# EAGLE design hermesONE Mini v1.0 (EAGLE 5.10)
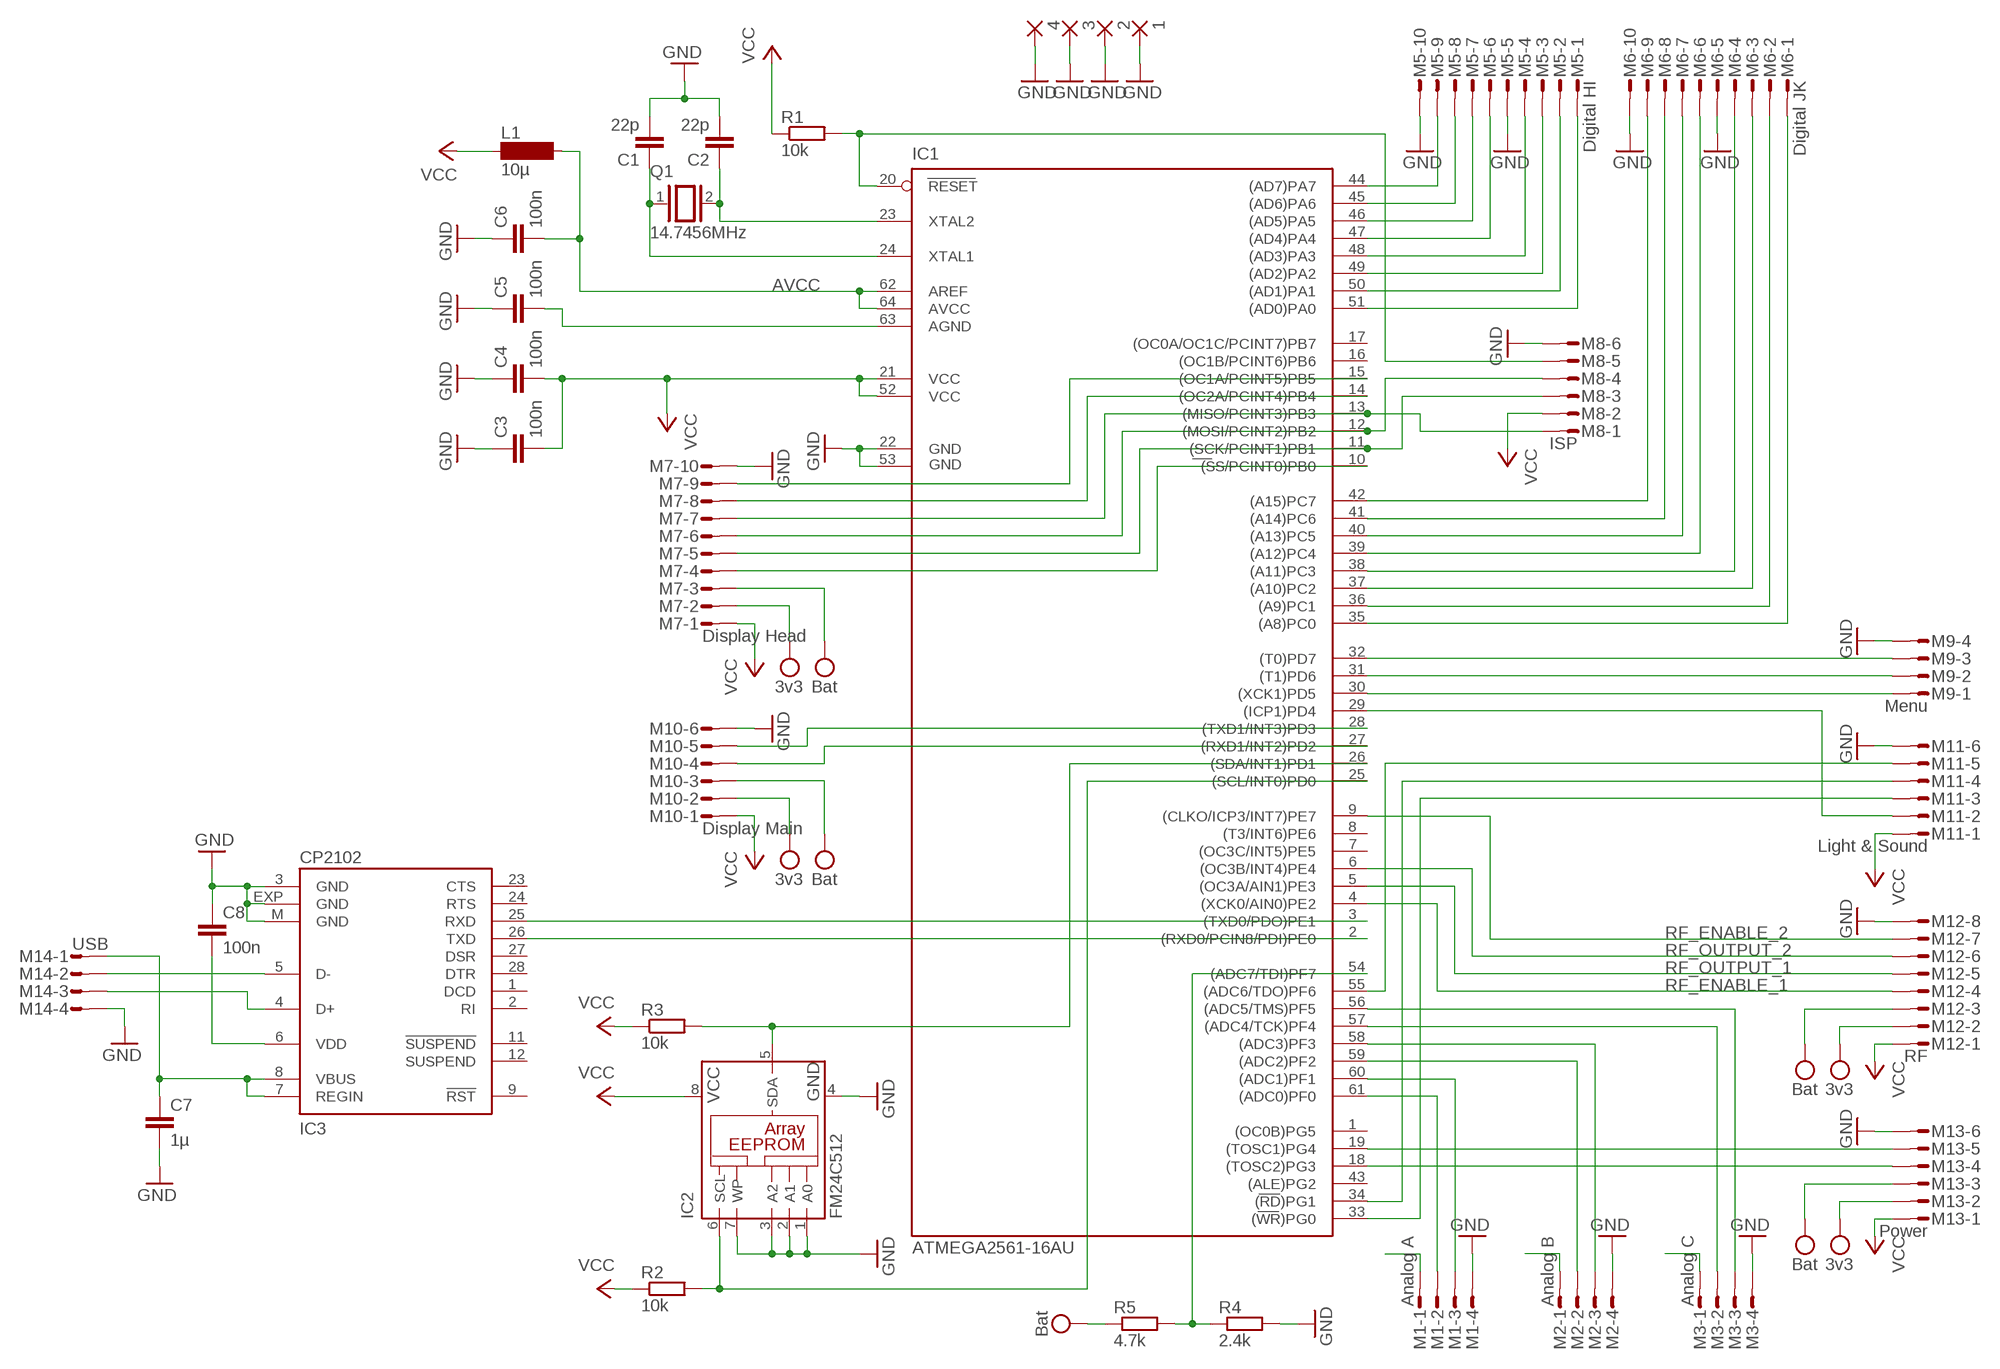
[diagram p0: schematic, sheet 1]

## Parts
1  2,54/1,1  [2,54/1,1]
2  2,54/1,1  [2,54/1,1]
3  2,54/1,1  [2,54/1,1]
4  2,54/1,1  [2,54/1,1]
C1  22p  C-EUC0805  [C0805]
C2  22p  C-EUC0805  [C0805]
C3  100n  C-EUC0805  [C0805]
C4  100n  C-EUC0805  [C0805]
C5  100n  C-EUC0805  [C0805]
C6  100n  C-EUC0805  [C0805]
C7  1µ  C-EUC0805  [C0805]
C8  100n  C-EUC0805  [C0805]
IC1  ATMEGA2561-16AU  [TQFP64]
IC2  FM24C512  24C64SM  [SO-08M]
IC3  CP2102  [MLP28]
L1  10µ  SM-1206  [SM-1206]
M1  Analog A  MICROMATCH-4  [MICROMATCH-4]
M2  Analog B  MICROMATCH-4  [MICROMATCH-4]
M3  Analog C  MICROMATCH-4  [MICROMATCH-4]
M5  Digital HI  MICROMATCH-10  [MICROMATCH-10]
M6  Digital JK  MICROMATCH-10  [MICROMATCH-10]
M7  Display Head  MICROMATCH-10  [MICROMATCH-10]
M8  ISP  MICROMATCH-6  [MICROMATCH-6]
M9  Menu  MICROMATCH-4  [MICROMATCH-4]
M10  Display Main  MICROMATCH-6  [MICROMATCH-6]
M11  Light & Sound  MICROMATCH-6  [MICROMATCH-6]
M12  RF  MICROMATCH-8  [MICROMATCH-8]
M13  Power  MICROMATCH-6  [MICROMATCH-6]
M14  USB  MICROMATCH-4  [MICROMATCH-4]
Q1  14.7456MHz  XTAL/S  [QS]
R1  10k  R-EU_R0805  [R0805]
R2  10k  R-EU_R0805  [R0805]
R3  10k  R-EU_R0805  [R0805]
R4  2.4k  R-EU_R0805  [R0805]
R5  4.7k  R-EU_R0805  [R0805]

## Nets
3V3: M7.2 M10.2 M12.2 M13.2 ; supply symbol labelled 3v3
ADC7: IC1.54((ADC7/TDI)PF7) R4.1 R5.2
AVCC: C6.2 IC1.62(AREF) IC1.64(AVCC) L1.2 M1.1 M2.1 M3.1
BAT: M7.3 M10.3 M12.3 M13.3 R5.1 ; supply symbol labelled Bat
GND: 1.1(P) 2.1(P) 3.1(P) 4.1(P) C1.2 C2.2 C3.1 C4.1 C5.1 C6.1 C7.2 C8.1 IC1.22(GND) IC1.53(GND1) IC2.1(A0) IC2.2(A1) IC2.3(A2) IC2.4(GND) IC2.7(WP) IC3.3(GND) IC3.EXP(GND) IC3.M(GND) M1.4 M2.4 M3.4 M5.5 M5.10 M6.5 M6.10 M7.10 M8.6 M9.4 M10.6 M11.6 M12.8 M13.6 M14.4 R4.2
N$1: C1.1 IC1.24(XTAL1) Q1.1
N$2: C2.1 IC1.23(XTAL2) Q1.2
N$4: IC3.5(D-) M14.2
N$6: IC1.51((AD0)PA0) M5.1
N$7: C5.2 IC1.63(AGND)
N$8: IC1.20(RESET) M8.5 R1.2
N$9: IC1.50((AD1)PA1) M5.2
N$10: IC1.11((SCK/PCINT1)PB1) M7.5 M8.3
N$11: IC1.12((MOSI/PCINT2)PB2) M7.6 M8.4
N$12: IC1.13((MISO/PCINT3)PB3) M7.7 M8.1
N$13: IC1.49((AD2)PA2) M5.3
N$14: IC1.48((AD3)PA3) M5.4
N$15: IC1.47((AD4)PA4) M5.6
N$16: IC1.46((AD5)PA5) M5.7
N$17: IC1.45((AD6)PA6) M5.8
N$18: IC1.44((AD7)PA7) M5.9
N$19: IC1.35((A8)PC0) M6.1
N$20: IC1.36((A9)PC1) M6.2
N$21: IC1.37((A10)PC2) M6.3
N$22: IC1.38((A11)PC3) M6.4
N$23: IC1.39((A12)PC4) M6.6
N$24: IC1.40((A13)PC5) M6.7
N$25: IC1.41((A14)PC6) M6.8
N$26: IC1.42((A15)PC7) M6.9
N$27: IC1.61((ADC0)PF0) M1.2
N$28: IC1.60((ADC1)PF1) M1.3
N$29: IC1.55((ADC6/TDO)PF6) M11.5
N$30: IC1.59((ADC2)PF2) M2.2
N$31: IC1.58((ADC3)PF3) M2.3
N$32: IC1.57((ADC4/TCK)PF4) M3.2
N$33: IC1.56((ADC5/TMS)PF5) M3.3
N$35: IC1.10((SS/PCINT0)PB0) M7.4
N$36: IC1.14((OC2A/PCINT4)PB4) M7.8
N$37: IC1.15((OC1A/PCINT5)PB5) M7.9
N$38: IC1.26((SDA/INT1)PD1) IC2.5(SDA) R3.2
N$39: IC1.2((RXD0/PCIN8/PDI)PE0) IC3.26(TXD)
N$40: IC1.30((XCK1)PD5) M9.1
N$41: IC1.31((T1)PD6) M9.2
N$42: IC1.32((T0)PD7) M9.3
N$43: IC1.27((RXD1/INT2)PD2) M10.4
N$44: IC1.28((TXD1/INT3)PD3) M10.5
N$45: IC1.29((ICP1)PD4) M11.2
N$49: IC1.33((WR)PG0) M11.3
N$50: IC1.34((RD)PG1) M11.4
N$51: IC1.18((TOSC2)PG3) M13.4
N$52: IC1.19((TOSC1)PG4) M13.5
N$54: IC3.4(D+) M14.3
N$55: C7.1 IC3.7(REGIN) IC3.8(VBUS) M14.1
N$56: C8.2 IC3.6(VDD)
N$57: IC1.3((TXD0/PDO)PE1) IC3.25(RXD)
RF_ENABLE_1: IC1.4((XCK0/AIN0)PE2) M12.4
RF_ENABLE_2: IC1.9((CLKO/ICP3/INT7)PE7) M12.7
RF_OUTPUT_1: IC1.5((OC3A/AIN1)PE3) M12.5
RF_OUTPUT_2: IC1.6((OC3B/INT4)PE4) M12.6
SCL: IC1.25((SCL/INT0)PD0) IC2.6(SCL) R2.2
VCC: C3.2 C4.2 IC1.21(VCC) IC1.52(VCC1) IC2.8(VCC) L1.1 M7.1 M8.2 M10.1 M11.1 M12.1 M13.1 R1.1 R2.1 R3.1
Unconnected: IC1.1((OC0B)PG5) IC1.7((OC3C/INT5)PE5) IC1.8((T3/INT6)PE6) IC1.16((OC1B/PCINT6)PB6) IC1.17((OC0A/OC1C/PCINT7)PB7) IC1.43((ALE)PG2) IC3.1(DCD) IC3.2(RI) IC3.9(!RST) IC3.11(!SUSPEND) IC3.12(SUSPEND) IC3.23(CTS) IC3.24(RTS) IC3.27(DSR) IC3.28(DTR)

## Library data of the parts
1-4 = wirepad:2,54/1,1: THROUGH-HOLE PAD
C1-C8 = rcl:C-EU: CAPACITOR, European symbol
IC1 = atmel-2005:ATMEGA2561*: MICROCONTROLLER 256 Kbytes FLASH 4 Kbytes EEPROM 8 Kbytes SRAM 54 General Purpose I/O pins 6-channels 16-bit PWM 2 x Serial USARTs 8-channels 10-bit A/D
IC2 = microchip:24*: Serial EEPROM I2C
IC3 = silabs:CP210*: Single-Chip USB to UART Bridge Source: www.silabs.com .. CP2101.pdf / cp2102.pdf
L1 = inductor-neosid:SM-1206: INDUCTOR SMD chip inductor
M1-M3 M9 M14 = con-amp-micromatch:MICROMATCH-4: MicroMaTch 4 7-215464-4 / 0-215464-4 Drawing Number C-215464 DDEController.pdf
M5-M7 = con-amp-micromatch:MICROMATCH-10: MicroMaTch 10 8-215464-0 / 1-215464-0 Drawing Number C-215464 DDEController.pdf
M8 M10 M11 M13 = con-amp-micromatch:MICROMATCH-6: MicroMaTch 6 7-215464-6 / 0-215464-6 Drawing Number C-215464 DDEController.pdf
M12 = con-amp-micromatch:MICROMATCH-8: MicroMaTch 8 7-215464-8 / 0-215464-8 Drawing Number C-215464 DDEController.pdf
Q1 = special:XTAL/S: CRYSTAL
R1-R5 = rcl:R-EU_: RESISTOR, European symbol

## Board
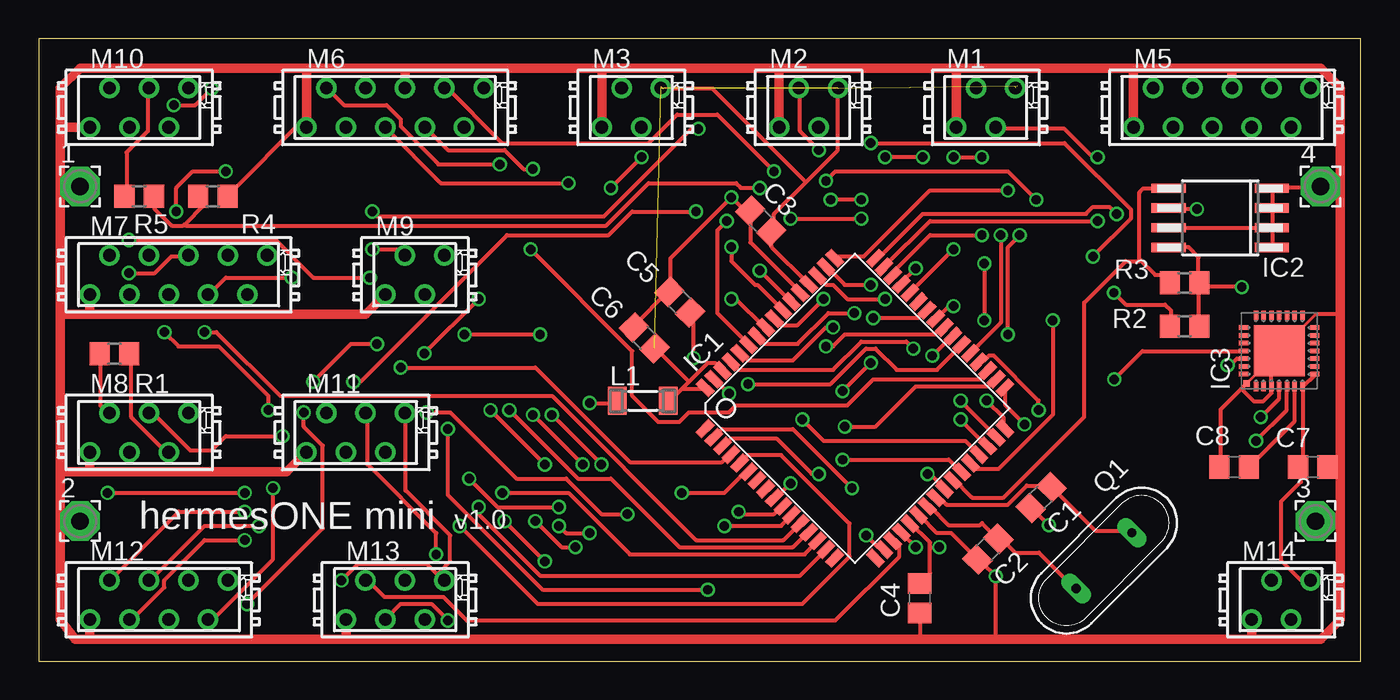
[diagram p1: board, top side]
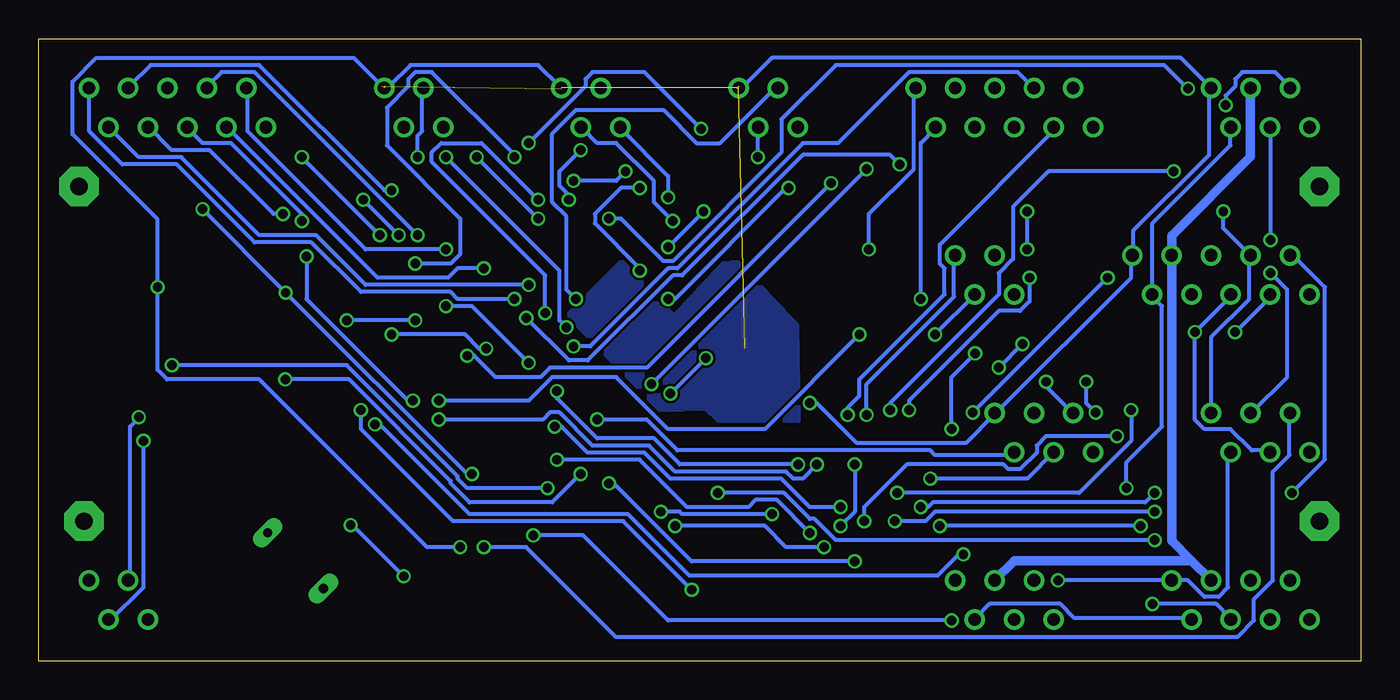
[diagram p2: board, bottom side, seen from below]

Size 85.27 x 40.12 mm. Coordinates in mm from the lower left corner, seen from the top.
Outline: 0,0 85.27,0 85.27,40.12 0,40.12 0,0
Copper layers (1*16): Top 0.035mm / dielectric 1.5mm / Bottom 0.035mm
Design rules "default *": minimum track width 8mil, minimum drill 24mil, track to track 6mil, track to pad 6mil, pad to pad 6mil, via to via 6mil, smd to smd 6mil, copper to edge 40mil, drill to drill 6mil, minimum pad ring 10mil, minimum via ring 6mil, stop-mask expansion 4mil, vias tented up to drill 0mil, thermal gap 10mil

### Footprints (pad centres in the part's own frame; a part is rotated, then mirrored left to right if it is on the bottom)
2,54/1,1 = drill 1.118 pad 2.54 octagon: 1 0,0
C0805 = smd 1.3 x 1.5: 1 -0.95,0; 2 0.95,0
TQFP64 = smd 1.194 x 0.559: 1 -7.76,5.905; 2 -7.76,5.118; 3 -7.76,4.331; 4 -7.76,3.543; 5 -7.76,2.756; 6 -7.76,1.968; 7 -7.76,1.181; 8 -7.76,0.394; 9 -7.76,-0.394; 10 -7.76,-1.181; 11 -7.76,-1.968; 12 -7.76,-2.756; 13 -7.76,-3.543; 14 -7.76,-4.331; 15 -7.76,-5.118; 16 -7.76,-5.905; 33 7.76,-5.905; 34 7.76,-5.118; 35 7.76,-4.331; 36 7.76,-3.543; 37 7.76,-2.756; 38 7.76,-1.968; 39 7.76,-1.181; 40 7.76,-0.394; 41 7.76,0.394; 42 7.76,1.181; 43 7.76,1.968; 44 7.76,2.756; 45 7.76,3.543; 46 7.76,4.331; 47 7.76,5.118; 48 7.76,5.905 | smd 0.559 x 1.194: 17 -5.905,-7.76; 18 -5.118,-7.76; 19 -4.331,-7.76; 20 -3.543,-7.76; 21 -2.756,-7.76; 22 -1.968,-7.76; 23 -1.181,-7.76; 24 -0.394,-7.76; 25 0.394,-7.76; 26 1.181,-7.76; 27 1.968,-7.76; 28 2.756,-7.76; 29 3.543,-7.76; 30 4.331,-7.76; 31 5.118,-7.76; 32 5.905,-7.76; 49 5.905,7.76; 50 5.118,7.76; 51 4.331,7.76; 52 3.543,7.76; 53 2.756,7.76; 54 1.968,7.76; 55 1.181,7.76; 56 0.394,7.76; 57 -0.394,7.76; 58 -1.181,7.76; 59 -1.968,7.76; 60 -2.756,7.76; 61 -3.543,7.76; 62 -4.331,7.76; 63 -5.118,7.76; 64 -5.905,7.76
SO-08M = smd 0.6 x 2.2: 1 -1.905,-3.33; 2 -0.635,-3.33; 3 0.635,-3.33; 4 1.905,-3.33; 5 1.905,3.33; 6 0.635,3.33; 7 -0.635,3.33; 8 -1.905,3.33
MLP28 = smd 0.6 x 0.3: 1 -2.3,1.5; 2 -2.3,1; 3 -2.3,0.5; 4 -2.3,0; 5 -2.3,-0.5; 6 -2.3,-1; 7 -2.3,-1.5; 15 2.3,-1.5; 16 2.3,-1; 17 2.3,-0.5; 18 2.3,0; 19 2.3,0.5; 20 2.3,1; 21 2.3,1.5 | smd 0.3 x 0.6: 8 -1.5,-2.3; 9 -1,-2.3; 10 -0.5,-2.3; 11 0,-2.3; 12 0.5,-2.3; 13 1,-2.3; 14 1.5,-2.3; 22 1.5,2.3; 23 1,2.3; 24 0.5,2.3; 25 0,2.3; 26 -0.5,2.3; 27 -1,2.3; 28 -1.5,2.3 | smd 3.3 x 3.3: EXP 0,0 | smd 0.435 x 0.435: M -2.103,2.103
SM-1206 = smd 1.2 x 1.8: 1 -1.65,0; 2 1.65,0
MICROMATCH-4 = drill 0.813 round: 1 1.905,1.27; 2 0.635,-1.27; 3 -0.635,1.27; 4 -1.905,-1.27
MICROMATCH-10 = drill 0.813 round: 1 5.715,1.27; 2 4.445,-1.27; 3 3.175,1.27; 4 1.905,-1.27; 5 0.635,1.27; 6 -0.635,-1.27; 7 -1.905,1.27; 8 -3.175,-1.27; 9 -4.445,1.27; 10 -5.715,-1.27
MICROMATCH-6 = drill 0.813 round: 1 3.175,1.27; 2 1.905,-1.27; 3 0.635,1.27; 4 -0.635,-1.27; 5 -1.905,1.27; 6 -3.175,-1.27
MICROMATCH-8 = drill 0.813 round: 1 4.445,1.27; 2 3.175,-1.27; 3 1.905,1.27; 4 0.635,-1.27; 5 -0.635,1.27; 6 -1.905,-1.27; 7 -3.175,1.27; 8 -4.445,-1.27
QS = drill 0.61 long: 1 -2.54,0; 2 2.54,0
R0805 = smd 1.3 x 1.5: 1 -0.95,0; 2 0.95,0

### Placement (x,y rotation side)
1  2.67,30.61 0 top
2  2.67,9.02 0 top
3  82.36,9.02 0 top
4  82.68,30.61 0 top
C1  64.64,10.54 225 top
C2  61.22,7.21 225 top
C3  46.57,28.37 315 top
C4  56.82,4.05 90 top
C5  41.33,23.14 315 top
C6  39.05,20.84 315 top
C7  82.18,12.52 0 top
C8  77.11,12.51 0 top
IC1  52.65,16.3 45 top
IC2  76.2,28.58 90 top
IC3  80.01,20 90 top
L1  38.96,16.77 0 top
M1  61.09,35.69 0 top
M2  49.66,35.69 0 top
M3  38.23,35.69 0 top
M5  76.33,35.69 0 top
M6  22.99,35.69 0 top
M7  9.02,24.89 0 top
M8  6.48,14.73 0 top
M9  24.26,24.89 0 top
M10  6.48,35.69 0 top
M11  20.45,14.73 0 top
M12  7.75,3.94 0 top
M13  22.99,3.94 0 top
M14  80.14,3.94 0 top
Q1  68.71,6.48 225 top
R1  4.89,19.81 180 top
R2  73.91,21.59 180 top
R3  73.91,24.38 180 top
R4  11.24,29.97 0 top
R5  6.48,29.97 0 top

### Tracks (layer width: path | path; a pad name or v marks a point on that pad's centre or on a via)
3V3  (via drill 0.61)
  Top 0.254: v15.11,11.15 15.11,6.58 11.3,2.77 11,2.77 M12.2
  Bottom 0.254: M12.2 11,2.77 18.47,2.77 19.38,3.68 23.95,3.68 24.87,2.77 M13.2 | M10.2 8.41,34.31 8.41,33.25 13.44,28.22 13.44,23.65 M7.2 13.44,23.5 12.83,22.89 12.83,15.11 15.11,12.83 v15.11,11.15
ADC7  (via drill 0.61)
  Top 0.254: 7.49,30.05 R5.2 7.49,29.9 7.49,29.13 8.56,28.07 9.32,28.07 9.4,28.14 | 10.24,30.05 R4.1 10.69,29.44 9.4,28.14 | v46.51,25.17 48.49,23.19 IC1.54 | v46.51,30.51 45.29,30.51 44.98,30.81 39.35,30.81 36.6,28.07 9.47,28.07 9.4,28.14
  Bottom 0.254: v46.51,25.17 46.51,25.32 49.4,28.22 49.4,28.83 47.73,30.51 v46.51,30.51
AVCC  (3 unrouted)
  Top 0.254: 41.48,17.55 42.85,17.55 IC1.64 | 41.48,17.55 40.72,16.79 L1.2 | 41.48,17.55 41.94,18.01 | 41.94,18.01 43.16,19.23 43.61,19.23 44.07,18.77 IC1.62 | 41.94,18.01 39.8,20.14 C6.2
  Bottom 0.254: 62.97,37.06 62.66,37.06 61.29,38.43 53.06,38.43 51.69,37.06 M2.1
BAT
  Top 0.254: R5.1 5.66,30.05 5.66,32.79 7.04,34.16 7.04,36.91 M10.3
  Bottom 0.61: M10.3 7.11,32.51 12.19,27.43 M7.3 12.19,7.75 10.92,6.48 | 10.92,6.48 22.35,6.48 M13.3 | M12.3 10.92,6.48
GND  (via drill 0.6, 0.61)
  Top 0.203: 82.36,22.35 | 82.36,22.35 IC3.M
  Top 0.254: 12.06,29.9 R4.2 12.22,30.05 17.09,34.93 M6.10 | 1.72,22.35 1.55,22.43 1.4,22.43 | C7.2 83.24,12.52 83.95,12.52 | IC3.M 77.9,17.86 | IC3.EXP 79.5,19.5 IC3.3 79.5,17.65 79.5,17.27 78.99,16.76 78.36,16.76 77.6,17.53 77.56,17.56 | 77.9,17.86 IC3.M | 83.95,22.35 82.36,22.35 | IC3.EXP | 77.9,17.86 77.86,17.86 77.56,17.56 | C8.1 76.23,12.52 76.23,16.22 77.56,17.56 | IC2.1 79.58,26.7 79.58,27.91 IC2.2 | IC2.7 72.87,27.91 79.43,27.91 IC2.2 | IC2.2 79.58,28.07 79.58,29.13 IC2.3 79.58,29.29 79.58,30.35 IC2.4 79.58,30.51 82.47,30.51 4.1 | IC1.22 56.87,9.32 57.94,8.25 58.85,8.25 60.53,6.58 C2.2 | C4.1 56.87,3.07 56.87,1.4 | 64.03,9.78 C1.2 64.14,9.78 v65.15,8.76 | C2.2 60.68,6.43 | C2.2 60.71,6.35 60.83,6.35 v61.72,5.46 61.72,1.4 | C6.1 38.43,21.67 40.56,23.8 C5.1 40.72,23.95 40.72,25.93 v44.68,29.9 45.44,29.13 45.75,29.13 C3.1 45.9,28.98 45.9,27 49.1,23.8 IC1.53
  Top 0.61: 1.4,9.02 1.4,12.19 | 17.27,38.23 2.67,38.23 1.4,36.96 1.4,34.42 | 17.27,38.23 23.62,38.23 | 23.62,38.23 36.32,38.23 | 36.32,38.23 47.75,38.23 | 47.75,38.23 59.18,38.23 | 59.18,38.23 70.61,38.23 | 76.96,38.23 70.61,38.23 | 76.96,38.23 82.68,38.23 83.95,36.96 83.95,30.61 | 36.32,38.23 M3.4 | 47.75,38.23 M2.4 | 59.18,38.23 M1.4 | 70.61,38.23 M5.10 | 1.4,9.02 1.4,2.67 2.35,1.4 3.3,1.4 | 1.4,9.02 2.1 | 1.4,30.61 1.4,34.42 | 1.4,30.61 1.1 | 3.3,1.4 19.81,1.4 | 76.96,38.23 M5.5 | 19.81,1.4 56.87,1.4 61.72,1.4 78.23,1.4 | 78.23,1.4 82.68,1.4 83.95,2.67 83.95,9.02 | 83.95,30.61 4.1 | 83.95,9.02 83.95,12.52 83.95,22.35 83.95,30.61 | 17.27,38.23 M6.10 | 1.4,34.42 M10.6 | 23.62,38.23 M6.5 | 83.95,9.02 3.1 | 3.3,1.4 M12.8 | 19.81,1.4 M13.6 | 78.23,1.4 M14.4 | M11.6 16,12.19 3.3,12.19 | 1.4,12.19 3.3,12.19 | 3.3,12.19 M8.6 | 1.4,12.19 1.4,22.43 1.4,30.61 | M9.4 21.08,22.35 3.3,22.35 | 1.72,22.35 3.3,22.35 | 3.3,22.35 M7.10
  Bottom 0.254: v44.68,29.9 44.68,31.27 47.73,34.31 M2.4 | v61.72,5.46 65.02,8.76 v65.15,8.76
N$1
  Top 0.254: IC1.24 57.94,10.39 58.24,10.39 58.55,10.08 62.51,10.08 63.73,11.3 65.25,11.3 C1.1 65.41,11.15 68.15,8.41 70.43,8.41 Q1.1
N$2
  Top 0.254: IC1.23 57.4,9.91 57.53,9.91 58.67,8.76 60.71,8.76 60.83,8.89 61.85,7.87 C2.1 61.98,8 62.99,6.99 64.52,6.99 66.8,4.7 Q1.2
N$3
  pour Bottom: 36.34,15.51 36.44,21.66 40.2,25.66 41.09,25.6 44.31,22.16 47.67,25.71 51.1,22.29 45.16,16.24 42.27,16.35 41.43,15.56
N$4  (via drill 0.61)
  Top 0.254: v78.51,14.2 80.49,16.18 80.49,17.55 IC3.5
  Bottom 0.254: v78.51,14.2 78.51,4.75 80.65,2.62 M14.2
N$6  (via drill 0.61)
  Top 0.254: v54.59,23.34 52.15,23.34 51.23,24.26 50.78,24.26 50.32,24.71 IC1.51
  Bottom 0.254: v54.59,23.34 58.24,23.34 58.7,23.8 64.49,23.8 67.69,27 71.35,27 76.38,32.03 79.88,32.03 82.02,34.16 82.02,36.91 M5.1
N$7  (via drill 0.61)
  Top 0.254: v44.53,17.25 43.61,18.16 IC1.63 | v42.24,19.53 42.24,22.28 42.09,22.43 C5.2
  Bottom 0.254: v44.53,17.25 v42.24,19.53
N$8  (via drill 0.61)
  Top 0.254: v56.57,7.34 55.65,8.25 IC1.20 | R1.2 3.99,19.69 3.99,16.48 4.45,16.03 M8.5
  Bottom 0.254: v56.57,7.34 53.82,7.34 48.03,1.55 7.95,1.55 6.88,2.62 6.88,3.99 5.66,5.21 5.66,12.22 4.6,13.28 4.6,15.88 M8.5
N$9  (via drill 0.61)
  Top 0.254: v53.67,24.26 51.99,24.26 50.93,25.32 IC1.50
  Bottom 0.254: v53.67,24.26 64.19,24.26 67.39,27.46 71.04,27.46 76.07,32.49 78.82,32.49 80.65,34.31 M5.2
N$10  (via drill 0.61)
  Top 0.254: v44.22,8.71 47.88,8.71 48.49,9.32 IC1.11 | v34.62,7.34 33.71,7.34 v32.03,9.02 | v15.72,14.5 12.06,14.5 11.15,13.59 9.78,13.59 7.49,15.88 7.19,15.88 M8.3 | v5.82,25.02 7.49,25.02 8.56,26.09 9.63,26.09 M7.5
  Bottom 0.254: v44.22,8.71 38.43,8.71 37.06,7.34 v34.62,7.34 | v32.03,9.02 32.03,9.93 29.29,12.68 23.04,12.68 22.73,12.37 21.97,12.37 20.9,13.44 20.9,13.89 20.29,14.5 v15.72,14.5 | v5.82,25.02 4.75,23.95 4.75,18.31 7.04,16.03 M8.3
N$11  (via drill 0.61)
  Top 0.254: v10.69,21.21 11.46,21.21 15.57,17.09 33.1,17.09 42.39,7.8 48.03,7.8 IC1.12
  Bottom 0.254: M7.6 8.41,23.5 v10.69,21.21 10.69,15.57 10.08,14.96 8.41,14.96 7.04,13.59 5.97,13.59 M8.4
N$12  (via drill 0.61)
  Top 0.254: v30.35,16.18 34.77,11.76 36.91,11.76 41.33,7.34 48.64,7.34 49.56,8.25 IC1.13 | v12.06,31.57 9.93,31.57 8.87,30.51 v8.87,28.98
  Bottom 0.254: v30.35,16.18 30.35,16.64 23.34,23.65 23.34,25.02 22.43,25.93 22.43,29.29 20.14,31.57 v12.06,31.57 | v8.87,28.98 8.87,27.91 M7.7 7.19,26.09 7.19,23.34 9.63,20.9 9.63,16.03 M8.1
N$13  (via drill 0.61)
  Top 0.254: v62.51,30.35 57.48,30.35 53.21,26.09 51.38,26.09 IC1.49
  Bottom 0.254: v62.51,30.35 62.97,30.35 71.04,38.43 78.05,38.43 79.43,37.06 M5.3
N$14  (via drill 0.61)
  Top 0.254: v69.52,28.83 69.06,29.29 68,29.29 67.54,28.83 57.02,28.83 54.28,26.09 53.98,26.09 IC1.48
  Bottom 0.254: v69.52,28.83 70.13,28.83 74.24,32.94 76.68,32.94 78.21,34.47 M5.4
N$15  (via drill 0.61)
  Top 0.254: v68.3,28.37 57.48,28.37 54.59,25.48 IC1.47
  Bottom 0.254: v68.3,28.37 68.3,28.83 72.87,33.4 74.7,33.4 75.62,34.31 M5.6
N$16  (via drill 0.61)
  Top 0.254: v60.83,27.46 57.48,27.46 55.19,25.17 55.19,24.87 IC1.46
  Bottom 0.254: v60.83,27.46 71.35,37.97 73.48,37.97 74.4,37.06 M5.7
N$17  (via drill 0.61)
  Top 0.254: v56.57,25.32 55.65,24.41 IC1.45
  Bottom 0.254: v56.57,25.32 58.24,25.32 58.85,24.71 63.42,24.71 73.03,34.31 M5.8
N$18  (via drill 0.61)
  Top 0.254: v59,26.54 56.26,23.8 IC1.44
  Bottom 0.254: v59,26.54 64.19,26.54 71.81,34.16 71.81,36.91 M5.9
N$19  (via drill 0.61)
  Top 0.254: v31.72,26.54 38.28,19.99 38.28,17.09 39.95,15.42 41.33,15.42 41.94,16.03 44.53,16.03 44.98,16.48 52.15,16.48 53.82,18.16 60.68,18.16 61.14,18.62 IC1.35
  Bottom 0.254: v31.72,26.54 31.72,28.83 28.83,31.73 28.83,36.91 M6.1
N$20  (via drill 0.61)
  Top 0.254: v64.49,16.18 64.49,16.79 61.59,19.69 61.29,19.69 60.99,19.38 60.68,19.38 IC1.36 | v43.16,4.6 32.49,4.6 26.39,10.69 v26.39,14.96 | v24.87,19.84 v28.37,23.34
  Bottom 0.254: v64.49,16.18 64.49,14.96 58.55,9.02 47.57,9.02 v43.16,4.6 | v26.39,14.96 26.39,18.31 v24.87,19.84 | v28.37,23.34 28.37,33.4 27.46,34.31 M6.2
N$21  (via drill 0.61)
  Top 0.254: v62.05,27.46 62.05,21.82 60.22,19.99 IC1.37 | v64.34,29.74 62.51,31.57 51.38,31.57 v50.78,30.96 | v47.42,31.57 43.76,35.23 41.17,35.23 39.35,33.4 29.9,33.4 26.24,37.06 M6.3
  Bottom 0.254: v64.34,29.74 v62.05,27.46 | v50.78,30.96 48.03,30.96 v47.42,31.57
N$22  (via drill 0.61)
  Top 0.254: v45.75,17.86 51.08,17.86 53.37,20.14 53.98,20.14 55.35,18.77 57.94,18.77 59.46,20.3 IC1.38 | v31.88,31.73 31.27,31.73 30.05,32.94 26.39,32.94 25.02,34.31 M6.4
  Bottom 0.254: v31.88,31.73 v45.75,17.86
N$23  (via drill 0.61)
  Top 0.254: v57.63,19.69 58.85,20.9 IC1.39 | v34.16,30.81 25.93,30.81 22.43,34.31 M6.6
  Bottom 0.254: v57.63,19.69 57.18,19.69 55.8,18.31 52.91,18.31 52.3,18.92 46.05,18.92 v34.16,30.81
N$24  (via drill 0.61)
  Top 0.254: v50.78,20.3 51.23,20.3 51.99,21.06 57.79,21.06 58.09,21.36 58.4,21.36 IC1.40
  Bottom 0.254: v50.78,20.3 49.71,20.3 44.68,25.32 44.07,25.32 35.99,33.4 33.71,33.4 29.13,37.97 22.12,37.97 21.21,37.06 M6.7
N$25  (via drill 0.61)
  Top 0.254: v59,22.89 58.7,22.89 57.94,22.12 IC1.41 | v51.84,17.4 v53.67,19.23 | v33.1,15.88 v36.3,12.68
  Bottom 0.254: v59,22.89 57.33,22.89 v53.67,19.23 | v51.84,17.4 51.84,16.94 49.25,14.35 45.59,14.35 43.92,12.68 v36.3,12.68 | v33.1,15.88 33.1,16.33 32.33,17.09 32.33,18.16 26.85,23.65 26.85,25.32 27.15,25.63 27.15,26.85 19.68,34.31 M6.8
N$26  (via drill 0.61)
  Top 0.254: v53.82,22.12 56.72,22.12 57.18,22.58 IC1.42 | v29.74,32.03 25.78,32.03 23.34,34.47 23.34,34.93 22.43,35.84 19.68,35.84 18.62,36.91 M6.9
  Bottom 0.254: v53.82,22.12 51.08,19.38 49.86,19.38 44.37,24.87 43.76,24.87 35.99,32.64 30.35,32.64 v29.74,32.03
N$27  (via drill 0.61)
  Top 0.254: v56.41,20.14 55.96,20.6 53.06,20.6 51.23,18.77 45.14,18.77 44.68,19.23 IC1.61 | v62.51,21.06 62.51,26.7 v63.27,27.46 | v68.3,32.49 68,32.49 66.17,34.31 61.75,34.31 M1.2
  Bottom 0.254: v56.41,20.14 56.87,20.14 57.79,21.06 v62.51,21.06 | v63.27,27.46 v68.3,32.49
N$28  (via drill 0.61)
  Top 0.254: v51.23,21.51 50.78,21.51 48.64,19.38 45.75,19.38 45.29,19.84 IC1.60 | v59,32.49 v60.83,32.49
  Bottom 0.254: v51.23,21.51 51.69,21.97 51.69,25.17 v59,32.49 | v60.83,32.49 60.83,33.86 60.53,34.16 60.53,36.91 M1.3
N$29  (via drill 0.61)
  Top 0.254: v44.68,26.7 44.68,25.78 46.2,24.26 46.36,24.26 47.88,22.73 IC1.55 | v42.39,28.98 38.28,28.98 36.75,27.46 30.2,27.46 20.75,18.01 v20.29,18.01
  Bottom 0.254: v42.39,28.98 v44.68,26.7 | v20.29,18.01 20.29,17.7 18.62,16.03 M11.5
N$30  (via drill 0.61)
  Top 0.254: v44.37,28.37 43.76,27.76 43.76,22.43 45.75,20.45 IC1.59
  Bottom 0.254: v44.37,28.37 45.59,29.59 45.59,30.96 48.03,33.4 49.25,33.4 50.17,34.31 M2.2
N$31  (via drill 0.61)
  Top 0.254: v52.6,22.43 50.93,22.43 48.95,20.45 46.81,20.45 46.36,20.9 IC1.58 | v53.06,29.74 v51.08,29.74 | v50.32,32.94 49.1,34.16 49.1,36.91 M2.3
  Bottom 0.254: v52.6,22.43 52.6,24.87 59.92,32.18 59.92,32.79 59.31,33.4 56.72,33.4 v53.06,29.74 | v51.08,29.74 51.08,30.05 51.69,30.66 51.69,31.57 v50.32,32.94
N$32  (via drill 0.61)
  Top 0.254: v44.68,23.34 44.98,23.34 46.81,21.51 IC1.57 | v36.91,30.51 v38.89,32.49
  Bottom 0.254: v44.68,23.34 44.22,23.34 37.06,30.51 v36.91,30.51 | v38.89,32.49 38.89,34.31 M3.2
N$33  (via drill 0.61)
  Top 0.254: v50.62,23.34 48.95,21.67 47.88,21.67 47.57,21.97 IC1.56
  Bottom 0.254: v50.62,23.34 51.23,23.95 51.23,28.68 52.15,29.59 52.15,34.01 50.62,35.54 44.98,35.54 42.85,33.4 41.33,33.4 37.67,37.06 M3.3
N$35  (via drill 0.61)
  Top 0.254: v45.14,9.63 45.29,9.47 47.42,9.47 47.88,9.93 IC1.10 | v37.97,9.47 36.3,9.47 34.01,11.76 30.81,11.76 26.54,16.03 v25.02,16.03 | v16.33,24.71 12.06,24.71 11,23.65 M7.4
  Bottom 0.254: v45.14,9.63 43.92,9.63 43.76,9.47 v37.97,9.47 | v16.33,24.71 v25.02,16.03
N$36  (via drill 0.61)
  Top 0.254: v29.9,10.85 34.16,10.85 38.12,6.88 49.4,6.88 50.17,7.65 IC1.14 | v14.81,16.18 14.81,17.09 11.61,20.3 9.02,20.3 v8.1,21.21
  Bottom 0.254: v29.9,10.85 18.16,10.85 14.81,14.2 v14.81,16.18 | v8.1,21.21 5.82,23.5 M7.8
N$37  (via drill 0.61)
  Top 0.254: v28.37,9.93 28.37,9.47 32.33,5.51 49.1,5.51 IC1.15 | v4.45,10.85 v13.28,10.85
  Bottom 0.254: v28.37,9.93 27.91,9.93 27.61,10.24 13.89,10.24 v13.28,10.85 | v4.45,10.85 2.31,12.98 2.31,24.11 4.45,26.24 M7.9
N$38
  Top 0.254: IC1.26 59.06,11.68 60.2,10.54 62.23,10.54 67.44,15.75 67.44,23.11 70.1,25.78 70.99,25.78 71.06,25.84 | R3.2 73.03,24.38 73.03,24.89 72.01,24.89 71.06,25.84 | 71.06,25.84 70.99,25.91 70.99,30.23 71.25,30.48 IC2.5
N$39  (via drill 0.61)
  Top 0.254: IC3.26 77.28,19.5 76.96,19.18 76.67,19.07 v76.68,19.07 | v52.45,11.15 48.64,14.96 44.07,14.96 43.61,14.5 IC1.2
  Bottom 0.254: v76.68,19.07 65.41,19.07 58.24,11.91 58.24,11.76 57.63,11.15 v52.45,11.15
N$40  (via drill 0.61)
  Top 0.254: v59.46,15.57 61.14,13.89 IC1.30 | v31.88,15.88 v35.08,12.68
  Bottom 0.254: v59.46,15.57 52.76,15.57 52.3,16.03 51.69,16.03 49.56,13.89 45.9,13.89 44.22,12.22 37.06,12.22 36.6,11.76 35.99,11.76 v35.08,12.68 | v31.88,15.88 31.88,17.86 26.24,23.5 26.24,26.09 M9.1
N$41  (via drill 0.61)
  Top 0.254: v59.46,16.79 61.75,14.5 IC1.31 | v27.46,21.06 v32.33,21.06
  Bottom 0.254: v59.46,16.79 53.67,16.79 52.15,18.31 48.03,18.31 44.68,14.96 38.43,14.96 v32.33,21.06 | M9.2 v27.46,21.06
N$42  (via drill 0.61)
  Top 0.254: v61.14,16.79 62.2,15.72 62.2,15.11 IC1.32 | v68,26.09 70.43,28.52 70.43,29.13 66.17,33.4 v53.67,33.4 | v42.55,34.31 42.09,34.31 36.45,28.68 21.82,28.68 v21.51,28.98 | v21.51,26.54 23.19,26.54 23.5,26.24 M9.3
  Bottom 0.254: v61.14,16.79 61.44,16.79 68,23.34 v68,26.09 | v53.67,33.4 50.01,37.06 50.01,37.52 49.56,37.97 46.2,37.97 v42.55,34.31 | v21.51,26.54 v21.51,28.98
N$43  (via drill 0.61)
  Top 0.254: v51.84,12.98 58.7,12.98 59.46,12.22 IC1.27 | v35.54,8.25 34.01,8.25 v33.55,8.71 | v29.13,16.18 v32.64,12.68 | v21.36,24.71 17.7,24.71 15.27,27.15 v5.82,27.15
  Bottom 0.254: v51.84,12.98 46.51,12.98 43.46,9.93 39.5,9.93 39.04,10.39 37.67,10.39 v35.54,8.25 | v33.55,8.71 32.64,9.63 v32.64,12.68 | v29.13,16.18 29.13,16.79 23.34,22.58 21.97,22.58 21.36,23.19 v21.36,24.71 | v5.82,27.15 5.82,34.31 M10.4
N$44  (via drill 0.61)
  Top 0.254: v65.41,21.97 65.41,15.88 61.9,12.37 60.53,12.37 60.22,12.68 IC1.28 | v60.99,25.63 v60.99,21.97 | v57.02,32.49 v54.59,32.49 | v48.49,28.52 v53.06,28.52 | v11.15,36.91 10.08,35.84 v8.71,35.84
  Bottom 0.254: v60.99,21.97 v65.41,21.97 | v60.99,25.63 58.7,25.63 58.09,26.24 58.09,28.52 62.81,33.25 62.81,35.69 61.44,37.06 61.44,37.52 60.99,37.97 59.92,37.97 54.59,32.64 v54.59,32.49 | v53.06,28.52 v57.02,32.49 | v48.49,28.52 47.73,28.52 44.98,25.78 44.37,25.78 37.36,32.79 37.36,34.93 33.86,38.43 12.67,38.43 v11.15,36.91 | v8.71,35.84 8.71,36.45 8.1,37.06 8.1,37.52 7.64,37.97 5.51,37.97 4.6,37.06 M10.5
N$45  (via drill 0.61)
  Top 0.254: v49.25,15.57 50.62,14.2 59.77,14.2 60.53,13.44 IC1.29
  Bottom 0.254: v49.25,15.57 46.05,15.57 44.07,13.59 27.76,13.59 27.46,13.28 22.58,13.28 22.43,13.44 M11.2
N$49  (via drill 0.61)
  Top 0.254: v63.58,15.27 62.36,16.48 62.36,17.55 IC1.33 | v25.63,6.88 25.63,8.25 21.21,12.68 21.21,15.88 M11.3
  Bottom 0.254: v63.58,15.27 63.27,15.27 57.48,9.47 47.27,9.47 43.31,5.51 27.3,5.51 25.93,6.88 v25.63,6.88
N$50  (via drill 0.61)
  Top 0.254: v51.99,15.11 53.98,15.11 56.57,17.7 61.29,17.7 IC1.34 | v33.55,9.93 29.59,9.93 v27.76,11.76
  Bottom 0.254: v51.99,15.11 51.54,15.11 49.86,13.44 46.2,13.44 44.53,11.76 37.36,11.76 35.54,9.93 v33.55,9.93 | v27.76,11.76 21.51,11.76 M11.4
N$51  (via drill 0.61)
  Top 0.254: v53.37,8.1 54.13,7.34 54.43,7.34 IC1.18 | v26.39,2.62 25.32,3.68 23.34,3.68 22.43,2.77 M13.4
  Bottom 0.254: v53.37,8.1 50.17,8.1 44.68,2.62 v26.39,2.62
N$52
  Top 0.254: IC1.19 55.19,7.65 55.5,7.34 55.5,6.73 51.38,2.62 27.61,2.62 26.09,4.14 22.28,4.14 21.21,5.21 M13.5
N$54  (via drill 0.61)
  Top 0.254: IC3.4 80.01,16.91 v78.82,15.72
  Bottom 0.254: 79.58,5.21 M14.3 79.38,5.33 79.38,15.11 78.87,15.62 v78.82,15.72
N$55
  Top 0.254: IC3.8 82.32,18.47 81.56,17.7 IC3.7 81.56,17.55 81.56,12.83 81.26,12.52 C7.1 81.41,12.83 81.41,11.56 80.14,10.29 80.14,6.48 81.41,5.21 M14.1
N$56
  Top 0.254: IC3.6 81.01,15.47 78.61,13.08 78.61,13.07 C8.2
N$57  (via drill 0.61)
  Top 0.254: v69.37,18.16 71.2,19.99 77.6,19.99 IC3.25 | v50.32,12.07 49.86,12.07 47.57,14.35 44.68,14.35 44.22,13.89 IC1.3
  Bottom 0.254: v69.37,18.16 65.25,18.16 58.7,11.61 58.7,11.46 57.48,10.24 52.15,10.24 v50.32,12.07
RF_ENABLE_1  (via drill 0.61)
  Top 0.254: v23.34,18.92 32.03,18.92 38.12,12.83 44.07,12.83 44.53,13.28 IC1.4 | v21.82,20.45 20.14,20.45 v17.7,18.01 | v17.09,16.03 17.09,15.11 18.31,13.89 18.31,8.56 v13.44,3.68
  Bottom 0.254: v21.82,20.45 v23.34,18.92 | v17.7,18.01 17.7,16.64 v17.09,16.03 | v13.44,3.68 9.32,3.68 8.41,2.77 M12.4
RF_ENABLE_2  (via drill 0.61)
  Top 0.254: v48.49,11.46 47.57,10.54 IC1.9 | v30.05,9.02 v32.64,6.43 | v13.28,9.63 9.02,9.63 4.6,5.21 M12.7
  Bottom 0.254: v48.49,11.46 48.18,11.46 43.16,6.43 v32.64,6.43 | v30.05,9.02 28.07,9.02 27.46,9.63 v13.28,9.63
RF_OUTPUT_1  (via drill 0.61)
  Top 0.254: v27.15,8.71 32.18,3.68 49.25,3.68 52.3,6.73 52.3,8.86 47.88,13.28 45.75,13.28 45.29,12.83 IC1.5 | v14.2,8.71 10.69,8.71 7.19,5.21 M12.5
  Bottom 0.254: v14.2,8.71 v27.15,8.71
RF_OUTPUT_2  (via drill 0.61)
  Top 0.254: v41.48,10.85 44.22,10.85 45.44,12.07 45.75,12.07 IC1.6 | v13.28,7.8 10.69,7.8 8.1,5.21 8.1,4.75 5.97,2.62 M12.6
  Bottom 0.254: v41.48,10.85 37.21,10.85 35.54,9.17 35.23,9.17 33.86,7.8 v13.28,7.8
SCL  (via drill 0.6, 0.61)
  Top 0.254: v57.33,12.07 57.48,12.07 58.4,11.15 IC1.25 | v74.7,29.13 72.87,29.13 IC2.6 | v69.34,23.75 70.1,22.99 72.64,22.99 73.03,22.61 73.03,21.59 R2.2
  Bottom 0.254: v57.33,12.07 57.63,12.07 69.39,23.82 | 69.39,23.82 v74.7,29.13 | 69.39,23.82 v69.34,23.75
VCC  (via drill 0.61)  (2 unrouted)
  Top 0.254: 57.48,7.34 57.48,5.66 56.87,5.06 C4.2 | 57.48,7.34 57.48,7.65 56.26,8.86 IC1.21 | 57.48,7.34 v58.09,7.34 | 49.48,30.89 51.54,32.94 51.54,36.91 | 49.48,30.89 47.42,28.83 47.42,27.76 C3.2 47.27,27.61 47.27,26.7 49.56,24.41 IC1.52 | 40.26,36.91 43.46,36.91 49.48,30.89 | R1.1 5.97,19.69 5.97,15.72 8.25,13.44 M8.2 | v19.53,5.21 20.6,6.27 25.02,6.27 26.09,5.21 M13.1 25.78,5.66 26.54,6.43 26.54,8.1 23.65,11 23.65,15.88 M11.1 | 74.8,24.13 74.8,21.59 R2.1 | 74.8,24.13 74.8,24.38 | 74.8,24.38 74.8,26.04 74.17,26.67 IC2.8 | 74.8,24.38 R3.1 74.8,24.13 | 74.8,24.13 77.6,24.13 v77.6,24.11 | v35.54,16.64 37.21,16.64 L1.1
  Bottom 0.254: v58.09,7.34 60.22,7.34 71.04,18.16 76.99,18.16 77.6,18.77 v77.6,24.11 77.6,28.47 83.08,33.96 83.08,37.36 81.56,38.89 64.95,38.89 63.12,37.06 | M8.2 8.56,13.28 8.56,4.75 9.17,4.14 10.08,4.14 11.15,5.21 M12.1 v19.53,5.21 | 40.11,37.06 39.8,37.06 37.97,38.89 11.61,38.89 9.78,37.06 M10.1 9.78,36.91 9.78,32.64 14.66,27.76 14.66,26.24 M7.1 14.81,26.09 14.81,24.71 23.5,16.03 M11.1 23.65,15.88 25.48,14.05 32.49,14.05 35.08,16.64 v35.54,16.64

### Text on the board
tPlace: hermesONE mini | v1.0